# Altium project BMU.PrjPCB
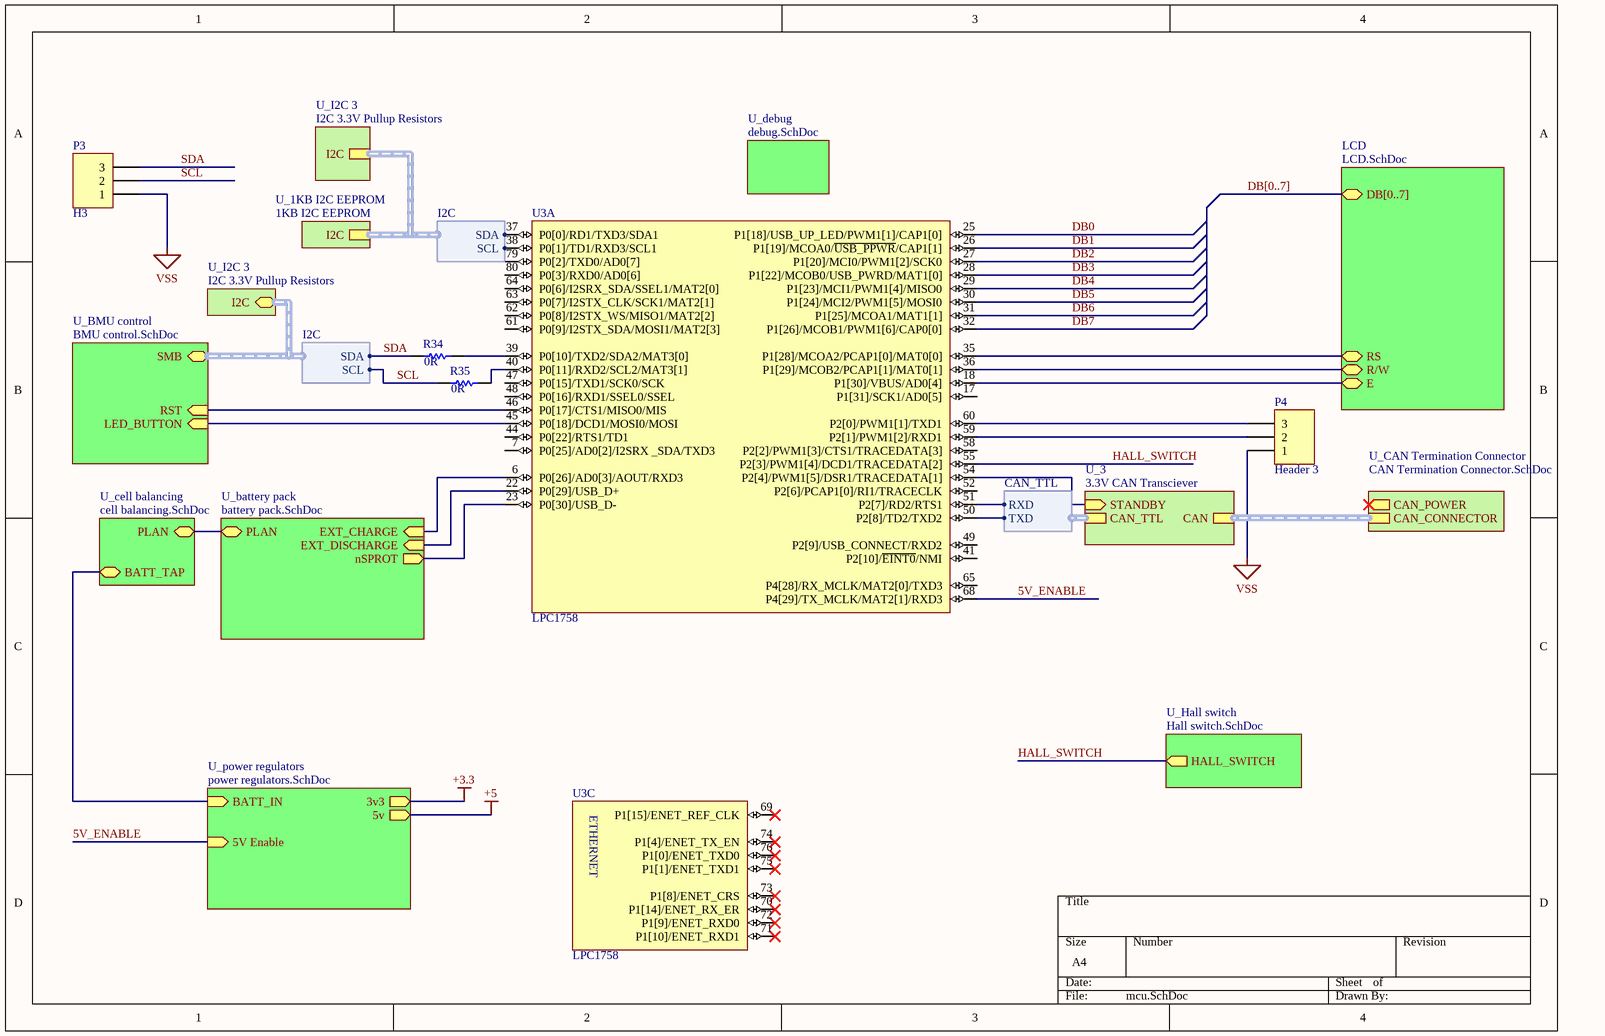
[diagram p0: mcu.SchDoc]
6 sheets, 87 parts. Net scope: hierarchical (ports join the sheet entries above them; power ports are global).
Board files: bms_strut.PcbDoc, BigStructuralPCB.PcbDoc, BMS.PcbDoc
Sheets:
  mcu.SchDoc
    U_BMU control = BMU control.SchDoc
    U_CAN Termination Connector = CAN Termination Connector.SchDoc
    U_battery pack = battery pack.SchDoc
    U_debug = debug.SchDoc
  powerpump.SchDoc

## Sheet mcu.SchDoc
size A4

### Parts
P3  H3  [HDR1X3]
P4  Header 3  [HDR1X3]
R34  value 0R  [R0603]  (hidden comment: Res1)
R35  value 0R  [R0603]  (hidden comment: Res1)
U3  LPC1758  [LPC1758FBD80]  (parts A,C of 3)

### Sub-sheets
LCD = LCD.SchDoc (file not in this document): DB[0..7], E, R/W, RS
U_1KB I2C EEPROM = 1KB I2C EEPROM (file not in this document): I2C (harness I2C)
U_3 = 3.3V CAN Transciever (file not in this document): CAN_TTL (harness CAN_TTL), CAN (harness CAN), STANDBY (in)
U_battery pack = battery pack.SchDoc: PLAN (bidir), EXT_CHARGE (in), EXT_DISCHARGE (in), nSPROT (out)
U_BMU control = BMU control.SchDoc: RST (in), LED_BUTTON (in), SMB (harness I2C)
U_CAN Termination Connector = CAN Termination Connector.SchDoc: CAN_CONNECTOR (harness CAN), CAN_POWER (out)
U_cell balancing = cell balancing.SchDoc (file not in this document): PLAN (bidir), BATT_TAP
U_debug = debug.SchDoc: no entries
U_Hall switch = Hall switch.SchDoc (file not in this document): HALL_SWITCH (out)
U_I2C 3 = I2C 3.3V Pullup Resistors (file not in this document): I2C (harness I2C)
U_I2C 3 = I2C 3.3V Pullup Resistors (file not in this document): I2C (harness I2C)
U_power regulators = power regulators.SchDoc (file not in this document): BATT_IN, 3v3 (out), 5v, 5V Enable (in)

### Harnesses
CAN_TTL: RXD, TXD
I2C: SCL, SDA

### Nets
+5: sheet U_power regulators/5v
VSS: P3.1 P4.1  [project net BATT-]
5V_ENABLE: U3.68(P4[29]/TX_MCLK/MAT2[1]/RXD3) ; sheet U_power regulators/5V Enable
DB0: U3.25(P1[18]/USB_UP_LED/PWM1[1]/CAP1[0])
DB1: U3.26(P1[19]/MCOA0/~{USB_PPWR}/CAP1[1])
DB2: U3.27(P1[20]/MCI0/PWM1[2]/SCK0)
DB3: U3.28(P1[22]/MCOB0/USB_PWRD/MAT1[0])
DB4: U3.29(P1[23]/MCI1/PWM1[4]/MISO0)
DB5: U3.30(P1[24]/MCI2/PWM1[5]/MOSI0)
DB6: U3.31(P1[25]/MCOA1/MAT1[1])
DB7: U3.32(P1[26]/MCOB1/PWM1[6]/CAP0[0])
EXT_CHARGE: U3.6(P0[26]/AD0[3]/AOUT/RXD3) ; sheet U_battery pack/EXT_CHARGE
EXT_DISCHARGE: U3.22(P0[29]/USB_D+) ; sheet U_battery pack/EXT_DISCHARGE
HALL_SWITCH: U3.55(P2[3]/PWM1[4]/DCD1/TRACEDATA[2]) ; sheet U_Hall switch/HALL_SWITCH
LED_BUTTON: U3.45(P0[18]/DCD1/MOSI0/MOSI) ; sheet U_BMU control/LED_BUTTON
nSPROT: U3.23(P0[30]/USB_D-) ; sheet U_battery pack/nSPROT
PLAN: sheet U_battery pack/PLAN, sheet U_cell balancing/PLAN
RST: U3.46(P0[17]/CTS1/MISO0/MIS) ; sheet U_BMU control/RST
SCL: P3.2 R35.1 ; sheet U_BMU control/SMB.SCL
SDA: P3.3 R34.1 ; sheet U_BMU control/SMB.SDA
NetP4_2: P4.2 U3.59(P2[1]/PWM1[2]/RXD1)
NetP4_3: P4.3 U3.60(P2[0]/PWM1[1]/TXD1)
NetR34_2: R34.2 U3.39(P0[10]/TXD2/SDA2/MAT3[0])
NetR35_2: R35.2 U3.40(P0[11]/RXD2/SCL2/MAT3[1])
NetU3_18: U3.18(P1[30]/VBUS/AD0[4]) ; sheet LCD/E
NetU3_35: U3.35(P1[28]/MCOA2/PCAP1[0]/MAT0[0]) ; sheet LCD/RS
NetU3_36: U3.36(P1[29]/MCOB2/PCAP1[1]/MAT0[1]) ; sheet LCD/R/W
NetU3_37: U3.37(P0[0]/RD1/TXD3/SDA1) ; sheet U_1KB I2C EEPROM/I2C.SDA
NetU3_38: U3.38(P0[1]/TD1/RXD3/SCL1) ; sheet U_1KB I2C EEPROM/I2C.SCL
NetU3_50: U3.50(P2[8]/TD2/TXD2) ; sheet U_3/CAN_TTL.TXD
NetU3_51: U3.51(P2[7]/RD2/RTS1) ; sheet U_3/CAN_TTL.RXD
NetU3_54: U3.54(P2[4]/PWM1[5]/DSR1/TRACEDATA[1]) ; sheet U_3/STANDBY
(unnamed): sheet U_cell balancing/BATT_TAP, sheet U_power regulators/BATT_IN

Not connected (* = marked no-connect by the designer): U3 7(P0[25]/AD0[2]/I2SRX__SDA/TXD3) 17(P1[31]/SCK1/AD0[5]) 41(P2[10]/~{EINT0}/NMI) 44(P0[22]/RTS1/TD1) 47(P0[15]/TXD1/SCK0/SCK) 48(P0[16]/RXD1/SSEL0/SSEL) 49(P2[9]/USB_CONNECT/RXD2) 52(P2[6]/PCAP1[0]/RI1/TRACECLK) 58(P2[2]/PWM1[3]/CTS1/TRACEDATA[3]) 61(P0[9]/I2STX_SDA/MOSI1/MAT2[3]) 62(P0[8]/I2STX_WS/MISO1/MAT2[2]) 63(P0[7]/I2STX_CLK/SCK1/MAT2[1]) 64(P0[6]/I2SRX_SDA/SSEL1/MAT2[0]) 65(P4[28]/RX_MCLK/MAT2[0]/TXD3) 69(P1[15]/ENET_REF_CLK)* 70(P1[14]/ENET_RX_ER)* 71(P1[10]/ENET_RXD1)* 72(P1[9]/ENET_RXD0)* 73(P1[8]/ENET_CRS)* 74(P1[4]/ENET_TX_EN)* 75(P1[1]/ENET_TXD1)* 76(P1[0]/ENET_TXD0)* 79(P0[2]/TXD0/AD0[7]) 80(P0[3]/RXD0/AD0[6])

### Buses and harness runs
bus DB[0..7] = sheet LCD/DB[0..7]
harness sheet U_1KB I2C EEPROM/I2C = sheet U_I2C 3/I2C
harness sheet U_3/CAN = sheet U_CAN Termination Connector/CAN_CONNECTOR
harness sheet U_BMU control/SMB = sheet U_I2C 3/I2C

### Notes on the sheet
- (in symbol LPC1758, part C) ETHERNET

### Library data of the parts
P3 = TXS0108E: Header, 3-Pin; LatestRevisionDate: 17-Jul-2002; LatestRevisionNote: Re-released for DXP Platform.; Publisher: Altium Limited
P4 = Header 3: Header, 3-Pin; LatestRevisionDate: 17-Jul-2002; LatestRevisionNote: Re-released for DXP Platform.; Publisher: Altium Limited
R34 R35 = Res1: Resistor; Published: 8-Jun-2000; LatestRevisionDate: 17-Jul-2002; LatestRevisionNote: Re-released for DXP Platform.; PackageReference: AXIAL-0.3; Publisher: Altium Limited; farnell: 9331662
U3 = LPC1758: NXP - LPC1758FBD80 - MCU, 32BIT, ARM CORTEX M3, 80LQFP; farnell: 1718545

## Sheet BMU control.SchDoc
size A4
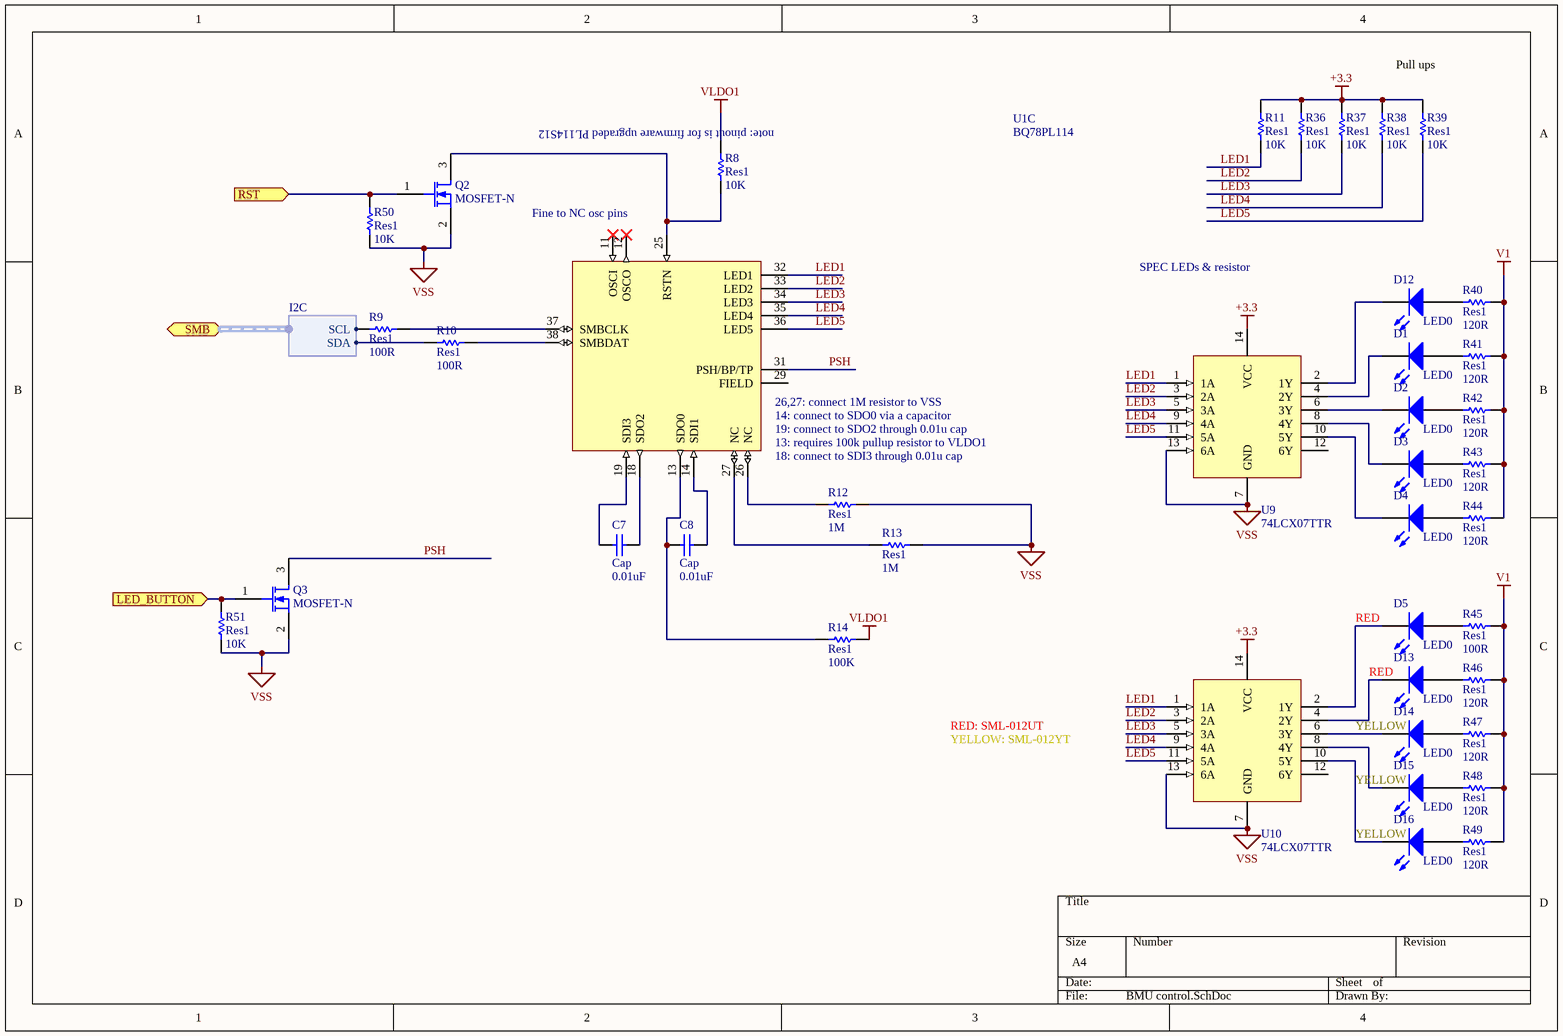
[diagram p1: BMU control.SchDoc]

### Parts
C7  Cap  value 0.01uF  [C0805]
C8  Cap  value 0.01uF  [C0805]
D1  LED0  [SML-01 (ROHM LED SERIES)]
D2  LED0  [SML-01 (ROHM LED SERIES)]
D3  LED0  [SML-01 (ROHM LED SERIES)]
D4  LED0  [SML-01 (ROHM LED SERIES)]
D5  LED0  colour: RED  [SML-01 (ROHM LED SERIES)]
D12  LED0  [SML-01 (ROHM LED SERIES)]
D13  LED0  colour: RED  [SML-01 (ROHM LED SERIES)]
D14  LED0  colour: YELLOW  [SML-01 (ROHM LED SERIES)]
D15  LED0  colour: YELLOW  [SML-01 (ROHM LED SERIES)]
D16  LED0  colour: YELLOW  [SML-01 (ROHM LED SERIES)]
Q2  MOSFET-N  [2N7002]
Q3  MOSFET-N  [2N7002]
R8  Res1  value 10K  [R0603]
R9  Res1  value 100R  [R0603]
R10  Res1  value 100R  [R0603]
R11  Res1  value 10K  [R0603]
R12  Res1  value 1M  [R0603]
R13  Res1  value 1M  [R0603]
R14  Res1  value 100K  [R0603]
R36  Res1  value 10K  [R0603]
R37  Res1  value 10K  [R0603]
R38  Res1  value 10K  [R0603]
R39  Res1  value 10K  [R0603]
R40  Res1  value 120R  [R0603]
R41  Res1  value 120R  [R0603]
R42  Res1  value 120R  [R0603]
R43  Res1  value 120R  [R0603]
R44  Res1  value 120R  [R0603]
R45  Res1  value 100R  [R0603]
R46  Res1  value 120R  [R0603]
R47  Res1  value 120R  [R0603]
R48  Res1  value 120R  [R0603]
R49  Res1  value 120R  [R0603]
R50  Res1  value 10K  [R0603]
R51  Res1  value 10K  [R0603]
U1  BQ78PL114  [QFN50P700X700X100-48N]  (part C of 3)
U9  74LCX07TTR  [74LCX07TTR]
U10  74LCX07TTR  [74LCX07TTR]

### Ports
LED_BUTTON (in), RST (in), SMB (harness I2C)

### Harnesses
I2C: SCL, SDA

### Nets
+3.3: R11.2 R36.2 R37.2 R38.2 R39.2 U9.14(VCC) U10.14(VCC)
V1: R40.1 R41.1 R42.1 R43.1 R44.1 R45.1 R46.1 R47.1 R48.1 R49.1
VLDO1: R8.1 R14.2
VSS: Q2.2(S) Q3.2(S) R12.2 R13.2 R50.1 R51.1 U9.7(GND) U9.13(6A) U10.7(GND) U10.13(6A)  [project net BATT-]
LED1: R11.1 U1.32(LED1) U9.1(1A) U10.1(1A)
LED2: R36.1 U1.33(LED2) U9.3(2A) U10.3(2A)
LED3: R37.1 U1.34(LED3) U9.5(3A) U10.5(3A)
LED4: R38.1 U1.35(LED4) U9.9(4A) U10.9(4A)
LED5: R39.1 U1.36(LED5) U9.11(5A) U10.11(5A)
LED_BUTTON: Q3.1(G) R51.2 ; port LED_BUTTON
PSH: Q3.3(D) U1.31(PSH/BP/TP)
RST: Q2.1(G) R50.2 ; port RST
SCL: R9.1 ; port SMB.SCL
SDA: R10.1 ; port SMB.SDA
NetC7_1: C7.1 U1.19(SDI3)
NetC7_2: C7.2 U1.18(SDO2)
NetC8_1: C8.1 R14.1 U1.13(SDO0)
NetC8_2: C8.2 U1.14(SDI1)
NetD1_1: D1.1(A) R41.2
NetD1_2: D1.2(K) U9.4(2Y)
NetD2_1: D2.1(A) R42.2
NetD2_2: D2.2(K) U9.6(3Y)
NetD3_1: D3.1(A) R43.2
NetD3_2: D3.2(K) U9.8(4Y)
NetD4_1: D4.1(A) R44.2
NetD4_2: D4.2(K) U9.10(5Y)
NetD5_1: D5.1(A) R45.2
NetD5_2: D5.2(K) U10.2(1Y)
NetD12_1: D12.1(A) R40.2
NetD12_2: D12.2(K) U9.2(1Y)
NetD13_1: D13.1(A) R46.2
NetD13_2: D13.2(K) U10.4(2Y)
NetD14_1: D14.1(A) R47.2
NetD14_2: D14.2(K) U10.6(3Y)
NetD15_1: D15.1(A) R48.2
NetD15_2: D15.2(K) U10.8(4Y)
NetD16_1: D16.1(A) R49.2
NetD16_2: D16.2(K) U10.10(5Y)
NetQ2_3: Q2.3(D) R8.2 U1.25(RSTN)
NetR9_2: R9.2 U1.37(SMBCLK)
NetR10_2: R10.2 U1.38(SMBDAT)
NetR12_1: R12.1 U1.26(NC)
NetR13_1: R13.1 U1.27(NC)

Not connected (* = marked no-connect by the designer): U1 11(OSCI)* 12(OSCO)* 29(FIELD); U9 12(6Y); U10 12(6Y)

### Notes on the sheet
- Pull ups
- (near U1) Fine to NC osc pins
- SPEC LEDs & resistor
- RED: SML-012UT
- YELLOW: SML-012YT
- (in symbol BQ78PL114, part C) note: pinout is for firmware upgraded PL114S12; 26,27: connect 1M resistor to VSS; 14: connect to SDO0 via a capacitor; 19: connect to SDO2 through 0.01u cap; 13: requires 100k pullup resistor to VLDO1; 18: connect to SDI3 through 0.01u cap

### Library data of the parts
C7 C8 = Cap: Capacitor; Published: 8-Jun-2000; LatestRevisionDate: 17-Jul-2002; LatestRevisionNote: Re-released for DXP Platform.; PackageReference: RAD-0.3; Publisher: Altium Limited; farnell: 1793837
Q2 Q3 = 2N7002: NXP - 2N7002 - MOSFET,N CH, 60V,0.3A,SOT23; farnell: 1510761
R8-R14 R36-R51 = Res1: Resistor; Published: 8-Jun-2000; LatestRevisionDate: 17-Jul-2002; LatestRevisionNote: Re-released for DXP Platform.; PackageReference: AXIAL-0.3; Publisher: Altium Limited
  R8 R11 R36-R39 R50 R51: farnell: 1576297
  R9 R10 R45: farnell: 9330364
  R12 R13: farnell: 9330410
  R14: farnell: 9330402
  R40-R44 R46-R49: farnell: 9330496
U1 = BQ78PL114: IC, BATT MANAGEMENT CONTRL, 48QFN; farnell: 1684746; digikey: 296-23814-1-ND
U9 U10 = 74LCX07TTR: STMICROELECTRONICS - 74LCX07TTR - IC, HEX BUFFER, SMD, TSSOP14; farnell: 1288488
D1-D5 D12-D16 = LED0: Published: 8-Jun-2000; LatestRevisionDate: 08-Jul-2005; LatestRevisionNote: Mech Layer 1 removed.; PackageReference: LED-0; Publisher: Altium Limited
  D1 D5 D12 D13: farnell: 1685047
  D2-D4 D14-D16: farnell: 1685048

## Sheet CAN Termination Connector.SchDoc
size A4
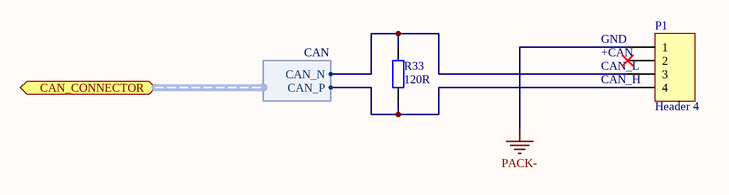
[diagram p2: CAN Termination Connector.SchDoc]

### Parts
P1  Header 4  [S04B-PASK-2]
R33  value 120R  [R0603]  (hidden comment: Res2)

### Ports
CAN_CONNECTOR (harness CAN)

### Harnesses
CAN: CAN_N, CAN_P

### Nets
PACK-: P1.1
NetP1_3: P1.3 R33.2 ; port CAN_CONNECTOR.CAN_N
NetP1_4: P1.4 R33.1 ; port CAN_CONNECTOR.CAN_P

Not connected (* = marked no-connect by the designer): P1 2*

### Notes on the sheet
- (near P1) GND
- (near P1) +CAN
- (near P1) CAN_L
- (near P1) CAN_H

### Library data of the parts
P1 = Header 4: Header, 4-Pin; LatestRevisionDate: 17-Jul-2002; LatestRevisionNote: Re-released for DXP Platform.; Publisher: Altium Limited; farnell: 1830749
R33 = Res2: Resistor; Published: 8-Jun-2000; LatestRevisionDate: 17-Jul-2002; LatestRevisionNote: Re-released for DXP Platform.; PackageReference: AXIAL-0.4; Publisher: Altium Limited; farnell: 9330496

## Sheet battery pack.SchDoc
size A4
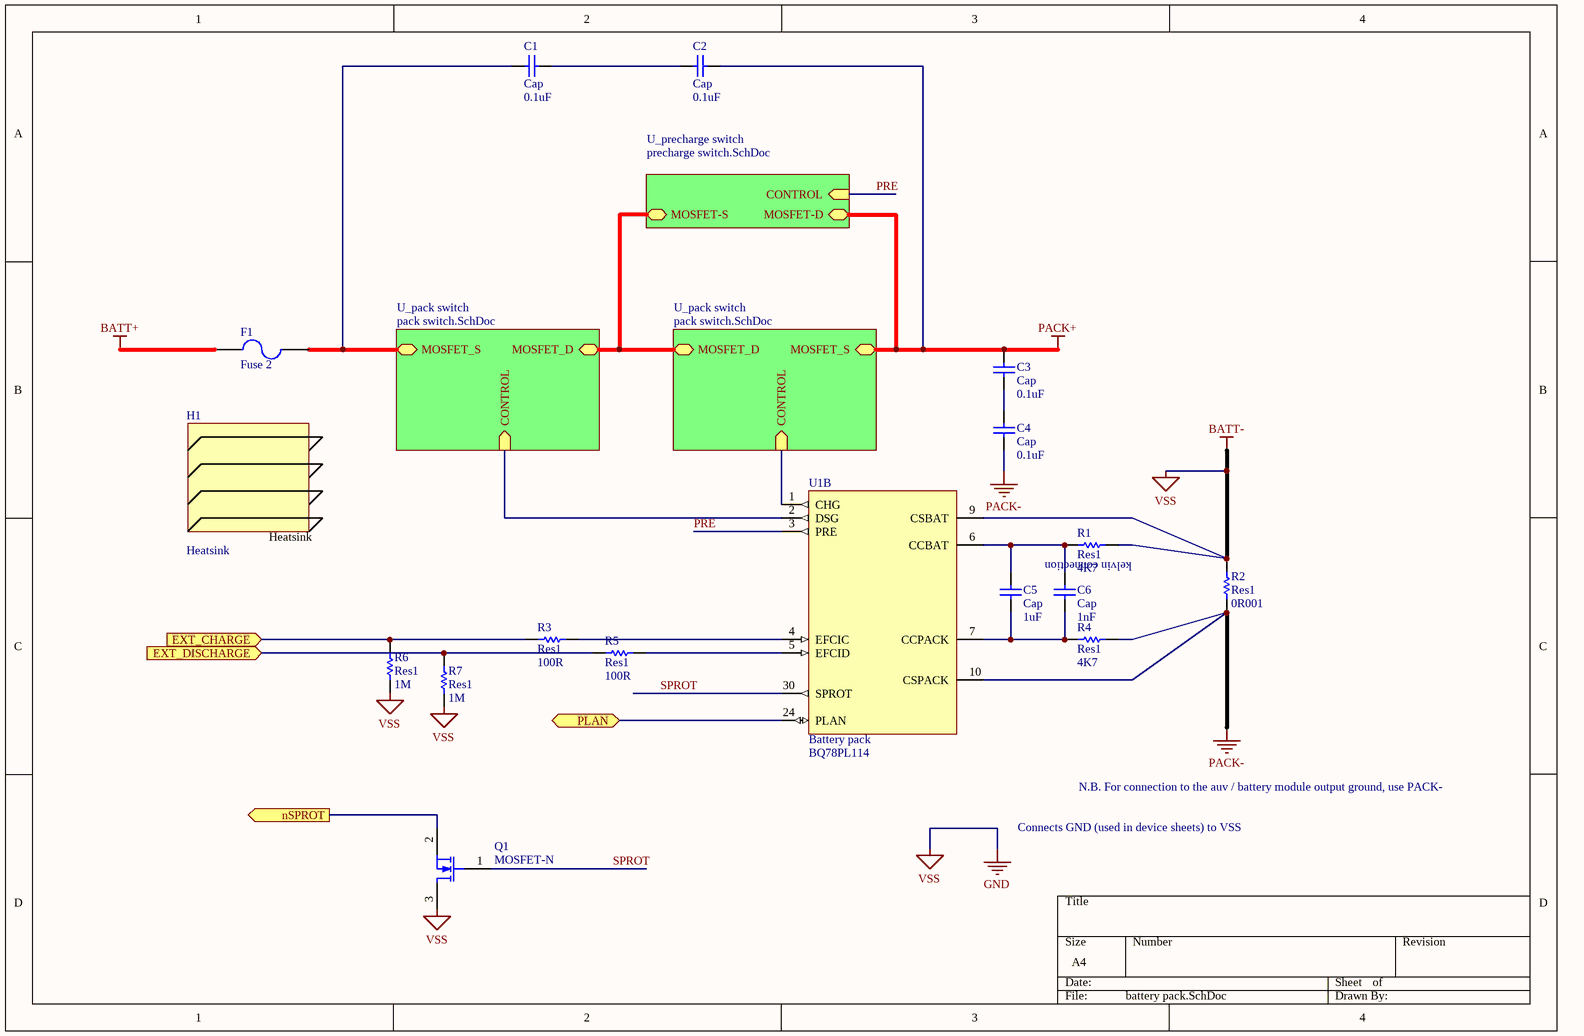
[diagram p3: battery pack.SchDoc]

### Parts
C1  Cap  value 0.1uF  [C0805]
C2  Cap  value 0.1uF  [C0805]
C3  Cap  value 0.1uF  [C0805]
C4  Cap  value 0.1uF  [C0805]
C5  Cap  value 1uF  [C0805]
C6  Cap  value 1nF  [C0805]
F1  Fuse 2  [FUSE outline]
H1  Heatsink
Q1  MOSFET-N  [2N7002]
R1  Res1  value 4K7  [R0603]
R2  Res1  value 0R001  [BCS80R001F]
R3  Res1  value 100R  [R0603]
R4  Res1  value 4K7  [R0603]
R5  Res1  value 100R  [R0603]
R6  Res1  value 1M  [R0603]
R7  Res1  value 1M  [R0603]
U1  BQ78PL114  [QFN50P700X700X100-48N]  (part B of 3)

### Sub-sheets
U_pack switch = pack switch.SchDoc (file not in this document): MOSFET_S (bidir), MOSFET_D (bidir), CONTROL (in)
U_pack switch = pack switch.SchDoc (file not in this document): MOSFET_S (bidir), MOSFET_D (bidir), CONTROL (in)
U_precharge switch = precharge switch.SchDoc (file not in this document): MOSFET-D (bidir), MOSFET-S (bidir), CONTROL (in)

### Ports
EXT_CHARGE (in), EXT_DISCHARGE (in), nSPROT (out), PLAN (bidir)

### Nets
BATT+: F1.2
BATT-: Q1.3(D) R1.2 R2.2 R6.2 R7.2 U1.9(CSBAT)  [also labelled GND, VSS]
PACK+: C2.2 C3.2 ; sheet U_pack switch/MOSFET_S, sheet U_precharge switch/MOSFET-D
PACK-: C4.1 R2.1 R4.2 U1.10(CSPACK)
EXT_CHARGE: R3.1 R6.1 ; port EXT_CHARGE
EXT_DISCHARGE: R5.1 R7.1 ; port EXT_DISCHARGE
nSPROT: Q1.2(S) ; port nSPROT
PLAN: U1.24(PLAN) ; port PLAN
PRE: U1.3(PRE) ; sheet U_precharge switch/CONTROL
SPROT: Q1.1(G) U1.30(SPROT)
NetC1_1: C1.1 F1.1 ; sheet U_pack switch/MOSFET_S
NetC1_2: C1.2 C2.1
NetC3_1: C3.1 C4.2
NetC5_1: C5.1 C6.1 R4.1 U1.7(CCPACK)
NetC5_2: C5.2 C6.2 R1.1 U1.6(CCBAT)
NetR3_2: R3.2 U1.4(EFCIC)
NetR5_2: R5.2 U1.5(EFCID)
NetU1_1: U1.1(CHG) ; sheet U_pack switch/CONTROL
NetU1_2: U1.2(DSG) ; sheet U_pack switch/CONTROL
(unnamed): sheet U_pack switch/MOSFET_D, sheet U_pack switch/MOSFET_D, sheet U_precharge switch/MOSFET-S

### Notes on the sheet
- (near R2) kelvin connection
- N.B. For connection to the auv / battery module output ground, use PACK-
- Connects GND (used in device sheets) to VSS
- (in symbol BQ78PL114, part B) Battery pack

### Library data of the parts
C1-C6 = Cap: Capacitor; Published: 8-Jun-2000; LatestRevisionDate: 17-Jul-2002; LatestRevisionNote: Re-released for DXP Platform.; PackageReference: RAD-0.3; Publisher: Altium Limited
  C1-C4: farnell: 1414664
  C5: farnell: 1759432
  C6: farnell: 1520296
F1 = Fuse 2: Fuse; Published: 8-Jun-2000; LatestRevisionDate: 17-Jul-2002; LatestRevisionNote: Re-released for DXP Platform.; PackageReference: PIN-W2/E2.8; Publisher: Altium Limited; mouser: 534-3550-2
Q1 = 2N7002: as Q2 on sheet BMU control; farnell: 1510761
R1 R3-R7 = Res1: Resistor; Published: 8-Jun-2000; LatestRevisionDate: 17-Jul-2002; LatestRevisionNote: Re-released for DXP Platform.; PackageReference: AXIAL-0.3; Publisher: Altium Limited
  R1 R4: farnell: 9331247
  R3 R5: farnell: 9330364
  R6 R7: farnell: 9330410
R2 = Res1: BI TECHNOLOGIES BCS80R001F; Published: 8-Jun-2000; LatestRevisionDate: 17-Jul-2002; LatestRevisionNote: Re-released for DXP Platform.; PackageReference: AXIAL-0.3; Publisher: Altium Limited; farnell: 1114443
U1 = BQ78PL114: IC, BATT MANAGEMENT CONTRL, 48QFN; farnell: 1684746; digikey: 296-23814-1-ND
H1 = Heatsink: farnell: 4302254

## Sheet debug.SchDoc
size A4
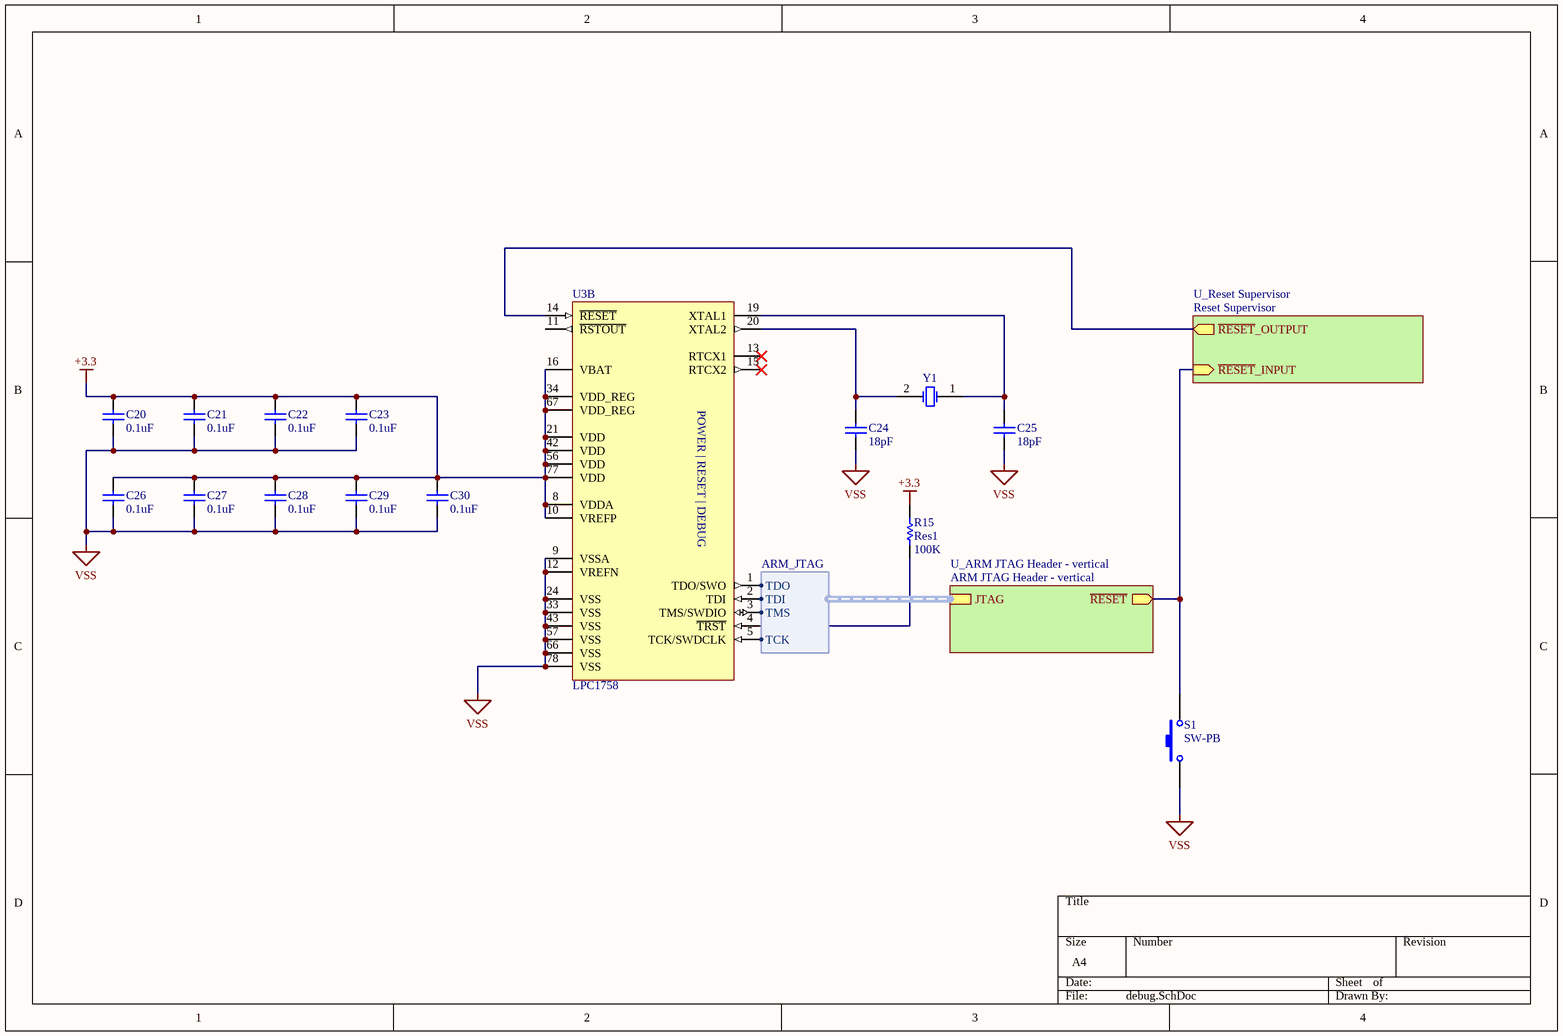
[diagram p4: debug.SchDoc]

### Parts
C20  value 0.1uF  [C0805]  (hidden comment: Cap)
C21  value 0.1uF  [C0805]  (hidden comment: Cap)
C22  value 0.1uF  [C0805]  (hidden comment: Cap)
C23  value 0.1uF  [C0805]  (hidden comment: Cap)
C24  value 18pF  [C0805]  (hidden comment: Cap)
C25  value 18pF  [C0805]  (hidden comment: Cap)
C26  value 0.1uF  [C0805]  (hidden comment: Cap)
C27  value 0.1uF  [C0805]  (hidden comment: Cap)
C28  value 0.1uF  [C0805]  (hidden comment: Cap)
C29  value 0.1uF  [C0805]  (hidden comment: Cap)
C30  value 0.1uF  [C0805]  (hidden comment: Cap)
R15  Res1  value 100K  [R0603]
S1  SW-PB  [DTSM-32S-B]
U3  LPC1758  [LPC1758FBD80]  (part B of 3)
Y1  XTAL  [C3E-24.000-12-3030-X]  (value not drawn)

### Sub-sheets
U_ARM JTAG Header - vertical = ARM JTAG Header - vertical (file not in this document): JTAG (harness ARM_JTAG), ~{RESET} (out)
U_Reset Supervisor = Reset Supervisor (file not in this document): ~{RESET}_OUTPUT (out), ~{RESET}_INPUT (in)

### Harnesses
ARM_JTAG: TCK, TDI, TDO, TMS

### Nets
+3.3: C20.1 C21.1 C22.1 C23.1 C26.1 C27.1 C28.1 C29.1 C30.1 R15.2 U3.8(VDDA) U3.10(VREFP) U3.16(VBAT) U3.21(VDD) U3.34(VDD_REG) U3.42(VDD) U3.56(VDD) U3.67(VDD_REG) U3.77(VDD)
VSS: C20.2 C21.2 C22.2 C23.2 C24.2 C25.2 C26.2 C27.2 C28.2 C29.2 C30.2 S1.1 U3.9(VSSA) U3.12(VREFN) U3.24(VSS) U3.33(VSS) U3.43(VSS) U3.57(VSS) U3.66(VSS) U3.78(VSS)  [project net BATT-]
NetC24_1: C24.1 U3.20(XTAL2) Y1.2(OSC2)
NetC25_1: C25.1 U3.19(XTAL1) Y1.1(OSC1)
NetR15_1: R15.1 U3.4(~{TRST})
NetS1_2: S1.2 ; sheet U_Reset Supervisor/~{RESET}_INPUT, sheet U_ARM JTAG Header - vertical/~{RESET}
NetU3_1: U3.1(TDO/SWO) ; sheet U_ARM JTAG Header - vertical/JTAG.TDO
NetU3_2: U3.2(TDI) ; sheet U_ARM JTAG Header - vertical/JTAG.TDI
NetU3_3: U3.3(TMS/SWDIO) ; sheet U_ARM JTAG Header - vertical/JTAG.TMS
NetU3_5: U3.5(TCK/SWDCLK) ; sheet U_ARM JTAG Header - vertical/JTAG.TCK
NetU3_14: U3.14(~{RESET}) ; sheet U_Reset Supervisor/~{RESET}_OUTPUT

Not connected (* = marked no-connect by the designer): U3 11(~{RSTOUT}) 13(RTCX1)* 15(RTCX2)*

### Notes on the sheet
- (in symbol LPC1758, part B) POWER | RESET | DEBUG

### Library data of the parts
C20-C30 = Cap: Capacitor; Published: 8-Jun-2000; LatestRevisionDate: 17-Jul-2002; LatestRevisionNote: Re-released for DXP Platform.; PackageReference: RAD-0.3; Publisher: Altium Limited
  C20-C23 C26-C30: farnell: 1414664
  C24 C25: farnell: 1414673
R15 = Res1: Resistor; Published: 8-Jun-2000; LatestRevisionDate: 17-Jul-2002; LatestRevisionNote: Re-released for DXP Platform.; PackageReference: AXIAL-0.3; Publisher: Altium Limited; farnell: 9330402
S1 = SW-PB: Switch; Published: 24-Mar-1999; LatestRevisionDate: 17-Jul-2002; LatestRevisionNote: Re-released for DXP Platform.; PackageReference: SPST-2; Publisher: Altium Limited; farnell: 9471898
U3 = LPC1758: as U3 on sheet mcu; farnell: 1718545
Y1 = XTAL: Crystal Oscillator; Published: 8-Jun-2000; LatestRevisionDate: 17-Jul-2002; LatestRevisionNote: Re-released for DXP Platform.; PackageReference: R38; Publisher: Altium Limited; farnell: 1538861

## Sheet powerpump.SchDoc
size A4
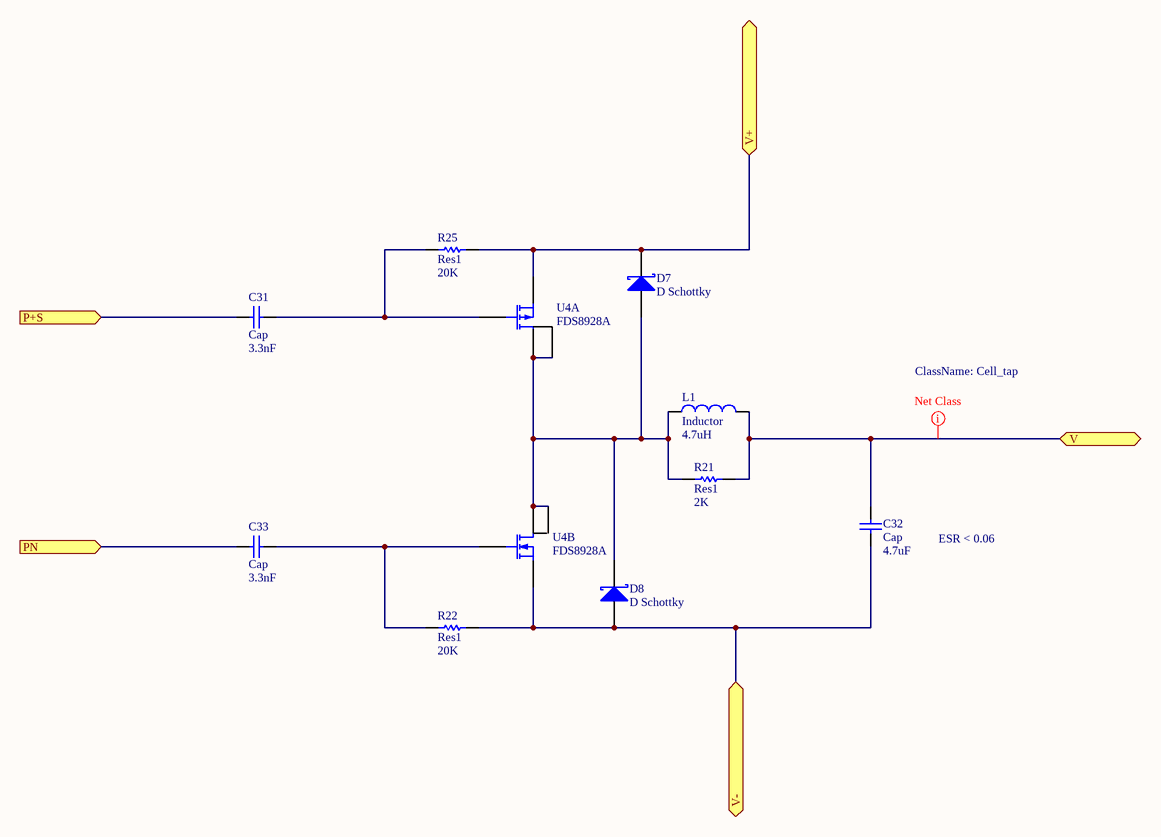
[diagram p5: powerpump.SchDoc]

### Parts
C31  Cap  value 3.3nF  [C0805]
C32  Cap  value 4.7uF  [C0805]
C33  Cap  value 3.3nF  [C0805]
D7  D Schottky  [B0520LW]
D8  D Schottky  [B0520LW]
L1  Inductor  value 4.7uH  [LQH44P]
R21  Res1  value 2K  [R0603]
R22  Res1  value 20K  [R0603]
R25  Res1  value 20K  [R0603]
U4  FDS8928A  [FDS8928A]  (parts A,B of 2)

### Ports
P+S (in), PN (in), V, V+, V-

### Nets
P+S: C31.1 ; port P+S
PN: C33.1 ; port PN
V: C32.1 L1.2 R21.2 ; port V
V+: D7.2(K) R25.2 U4.3(S_P) ; port V+
V-: C32.2 D8.1(A) R22.2 U4.1(S_N) ; port V-
NetC31_2: C31.2 R25.1 U4.4(G_P)
NetC33_2: C33.2 R22.1 U4.2(G_N)
NetD7_1: D7.1(A) D8.2(K) L1.1 R21.1 U4.5(D_P) U4.6(D_N) U4.7(D_N) U4.8(D_N)

### Layout directives
net class Cell_tap: V

### Notes on the sheet
- ESR < 0.06

### Library data of the parts
C31-C33 = Cap: Capacitor; Published: 8-Jun-2000; LatestRevisionDate: 17-Jul-2002; LatestRevisionNote: Re-released for DXP Platform.; PackageReference: RAD-0.3; Publisher: Altium Limited; ClassName: PowerPump
  C31 C33: farnell: 1759239
  C32: farnell: 1845746
D7 D8 = D Schottky: Schottky Diode; pin to pad: 1>A 2>K; Published: 8-Jun-2000; LatestRevisionDate: 17-Jul-2002; LatestRevisionNote: Re-released for DXP Platform.; PackageReference: SMB; Publisher: Altium Limited; Code_JEDEC: DO-214-AA; farnell: 1863141; ClassName: PowerPump
L1 = Inductor: Code_IEC: 1005; Published: 8-Jun-2000; LatestRevisionDate: 29-May-2009; LatestRevisionNote: IPC-7351 Footprint Added.; PackageReference: 0402-A; Publisher: Altium Limited; PackageDescription: Chip Inductor; Code_JEITA: 0402; farnell: 1782798; ClassName: PowerPump
R21 R22 R25 = Res1: Resistor; Published: 8-Jun-2000; LatestRevisionDate: 17-Jul-2002; LatestRevisionNote: Re-released for DXP Platform.; PackageReference: AXIAL-0.3; Publisher: Altium Limited; ClassName: PowerPump
  R21: farnell: 2059609
  R22 R25: farnell: 2059636
U4 = FDS8928A: MOSFET, DUAL, NP, SMD, 8-SOIC; farnell: 1467988

## Nets that join several sheets
+3.3: BMU control (7 pins), debug (19 pins)
BATT-: mcu (P3.1 P4.1), BMU control (10 pins), battery pack (6 pins), debug (20 pins)
PACK-: CAN Termination Connector (P1.1), battery pack (C4.1 R2.1 R4.2 U1.10)
EXT_CHARGE: mcu (U3.6), battery pack (R3.1 R6.1)
EXT_DISCHARGE: mcu (U3.22), battery pack (R5.1 R7.1)
LED_BUTTON: mcu (U3.45), BMU control (Q3.1 R51.2)
nSPROT: mcu (U3.23), battery pack (Q1.2)
RST: mcu (U3.46), BMU control (Q2.1 R50.2)
SCL: mcu (P3.2 R35.1), BMU control (R9.1)
SDA: mcu (P3.3 R34.1), BMU control (R10.1)